# EAGLE design usbtinyisp_v2.0 (EAGLE 4.13)
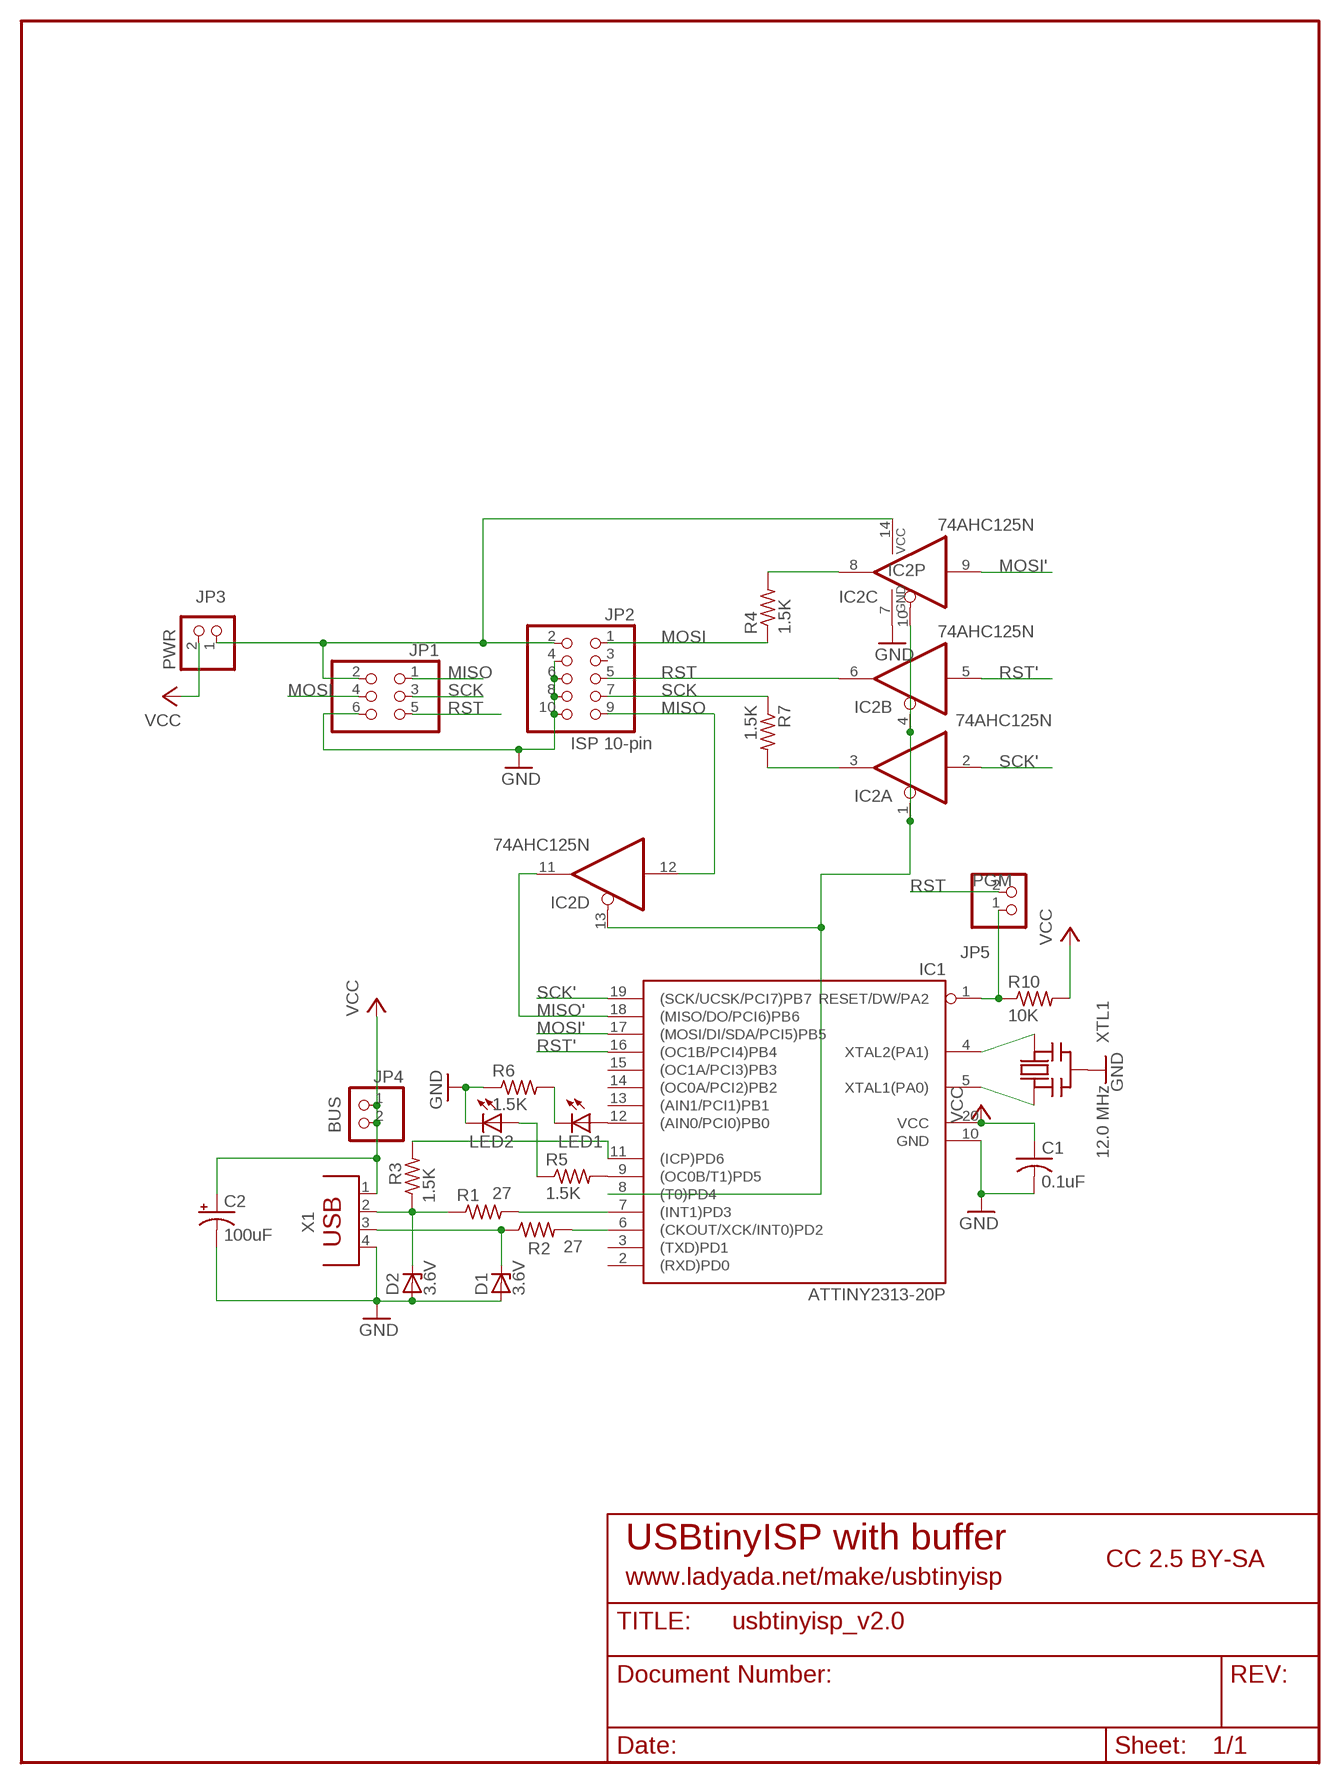
[diagram p0: schematic, sheet 1]

## Parts
C1  0.1uF  C-US025-025X050  [C025-025X050]
C2  100uF  CPOL-USE2.5-5  [E2,5-5]
D1  3.6V  ZENER-DIODEDO35Z10  [DO35Z10]
D2  3.6V  ZENER-DIODEDO35Z10  [DO35Z10]
IC1  ATTINY2313-20P  [DIL20]
IC2  74AHC125N  74HC125N  [DIL14]
JP1  PINHD-2X3  [2X03]
JP2  ISP 10-pin  PINHD-2X5  [2X05]
JP3  PWR  PINHD-1X2  [1X02]
JP4  BUS  PINHD-1X2  [1X02]
JP5  PGM  PINHD-1X2  [1X02]
LED1  LED3MM  [LED3MM]
LED2  LED3MM  [LED3MM]
R1  27  R-US_0207/10  [0207/10]
R2  27  R-US_0207/5V  [0207/5V]
R3  1.5K  R-US_0207/5V  [0207/5V]
R4  1.5K  R-US_0207/10  [0207/10]
R5  1.5K  R-US_0207/5V  [0207/5V]
R6  1.5K  R-US_0207/5V  [0207/5V]
R7  1.5K  R-US_0207/10  [0207/10]
R10  10K  R-US_0207/10  [0207/10]
X1  PN61729  [PN61729]
XTL1  12.0 MHz  CERMOSCILL  [CERM_OSC]

## Nets
GND: C1.2 C2.- D1.A D2.A IC1.10(GND) IC2.7(P:GND) JP1.6 JP2.4 JP2.6 JP2.8 JP2.10 LED2.K(C) R6.1 X1.4 XTL1.P$2(GND)
MISO: IC2.12(D:I) JP1.1 JP2.9
MISO': IC1.18((MISO/DO/PCI6)PB6) IC2.11(D:O)
MOSI: JP1.4 JP2.1 R4.1
MOSI': IC1.17((MOSI/DI/SDA/PCI5)PB5) IC2.9(C:I)
N$1: D2.C R1.1 R3.1 X1.2
N$2: D1.C R2.1 X1.3
N$3: IC1.7((INT1)PD3) R1.2
N$4: IC1.5(XTAL1(PA0)) XTL1.P$3(OUT)
N$5: IC1.4(XTAL2(PA1)) XTL1.P$1(IN)
N$6: IC1.6((CKOUT/XCK/INT0)PD2) R2.2
N$7: IC1.12((AIN0/PCI0)PB0) LED1.A
N$8: LED1.K(C) R6.2
N$9: IC1.1(RESET/DW/PA2) JP5.1 R10.1
N$10: IC1.9((OC0B/T1)PD5) R5.2
N$11: LED2.A R5.1
N$12: IC2.3(A:O) R7.2
N$13: IC2.8(C:O) R4.2
N$14: IC2.14(P:VCC) JP1.2 JP2.2 JP3.1
N$15: IC1.8((T0)PD4) IC2.1(A:OE) IC2.4(B:OE) IC2.10(C:OE) IC2.13(D:OE)
N$16: IC1.11((ICP)PD6) R3.2
RST: IC2.6(B:O) JP1.5 JP2.5 JP5.2
RST': IC1.16((OC1B/PCI4)PB4) IC2.5(B:I)
SCK: JP1.3 JP2.7 R7.1
SCK': IC1.19((SCK/UCSK/PCI7)PB7) IC2.2(A:I)
VCC: C1.1 C2.+ IC1.20(VCC) JP3.2 JP4.1 JP4.2 R10.2 X1.1
Unconnected: IC1.2((RXD)PD0) IC1.3((TXD)PD1) IC1.13((AIN1/PCI1)PB1) IC1.14((OC0A/PCI2)PB2) IC1.15((OC1A/PCI3)PB3) JP2.3

## Notes on the sheet
- USBtinyISP with buffer
- CC 2.5 BY-SA
- www.ladyada.net/make/usbtinyisp

## Library data of the parts
C1 = rcl-ez:C-US: CAPACITOR, American symbol
C2 = rcl-ez:CPOL-US: POLARIZED CAPACITOR, American symbol
D1 D2 = diode:ZENER-DIODE: Z-Diode
IC1 = avr:ATTINY2313: MICROCONTROLLER 2 Kbytes FLASH 128 bytes SRAM 128 bytes EEPROM USART USI
IC2 = 74xx-eu:74*125: Quad bus BUFFER, 3-state
JP1 = pinhead-ez:PINHD-2X3: PIN HEADER
JP2 = sonar:PINHD-2X5: PIN HEADER
JP3-JP5 = pinhead:PINHD-1X2: PIN HEADER
LED1 LED2 = minimidi:LED: LED OSRAM: - CHIPLED LG R971, LG N971, LY N971, LG Q971, LY Q971, LO R971, LY R971 LH N974, LH R974 LS Q976, LO Q976, LY Q976 LO Q996 - Hyper CHIPLED LW Q18S LB Q993, LB Q99A, LB R99A - SideLED LS A670, LO A670, LY A670, LG A670, LP A670 LB A673, LV A673, LT A673, LW A673 LH A674 LY A675 LS A676, LA A676, LO A676, LY A676, LW A676 LS A679, LY A679, LG A679 - Hyper Micro SIDELED® LS Y876, LA Y876, LO Y876, LY Y876 LT Y87S - SmartLED LW L88C, LW L88S LB L89C, LB L89S, LG L890 LS L89K, LO L89K, LY L89K LS L896, LA L896, LO L896, LY L896 - TOPLED LS T670, LO T670, LY T670, LG T670, LP T670 LSG T670, LSP T670, LSY T670, LOP T670, LYG T670 LG T671, LOG T671, LSG T671 LB T673, LV T673, LT T673, LW T673 LH T674 LS T676, LA T676, LO T676, LY T676, LB T676, LH T676, LSB T676, LW T676 LB T67C, LV T67C, LT T67C, LS T67K, LO T67K, LY T67K, LW E67C LS E67B, LA E67B, LO E67B, LY E67B, LB E67C, LV E67C, LT E67C LW T67C LS T679, LY T679, LG T679 LS T770, LO T770, LY T770, LG T770, LP T770 LB T773, LV T773, LT T773, LW T773 LH T774 LS E675, LA E675, LY E675, LS T675 LS T776, LA T776, LO T776, LY T776, LB T776 LHGB T686 LT T68C, LB T68C - Hyper Mini TOPLED® LB M676 - Mini TOPLED Santana® LG M470 LS M47K, LO M47K, LY M47K Source: http://www.osram.convergy.de/
R1-R7 R10 = rcl-ez:R-US_: RESISTOR, American symbol
X1 = con-berg-ez:PN61729: BERG USB connector
XTL1 = minimidi:CERMOSCILL

## Board
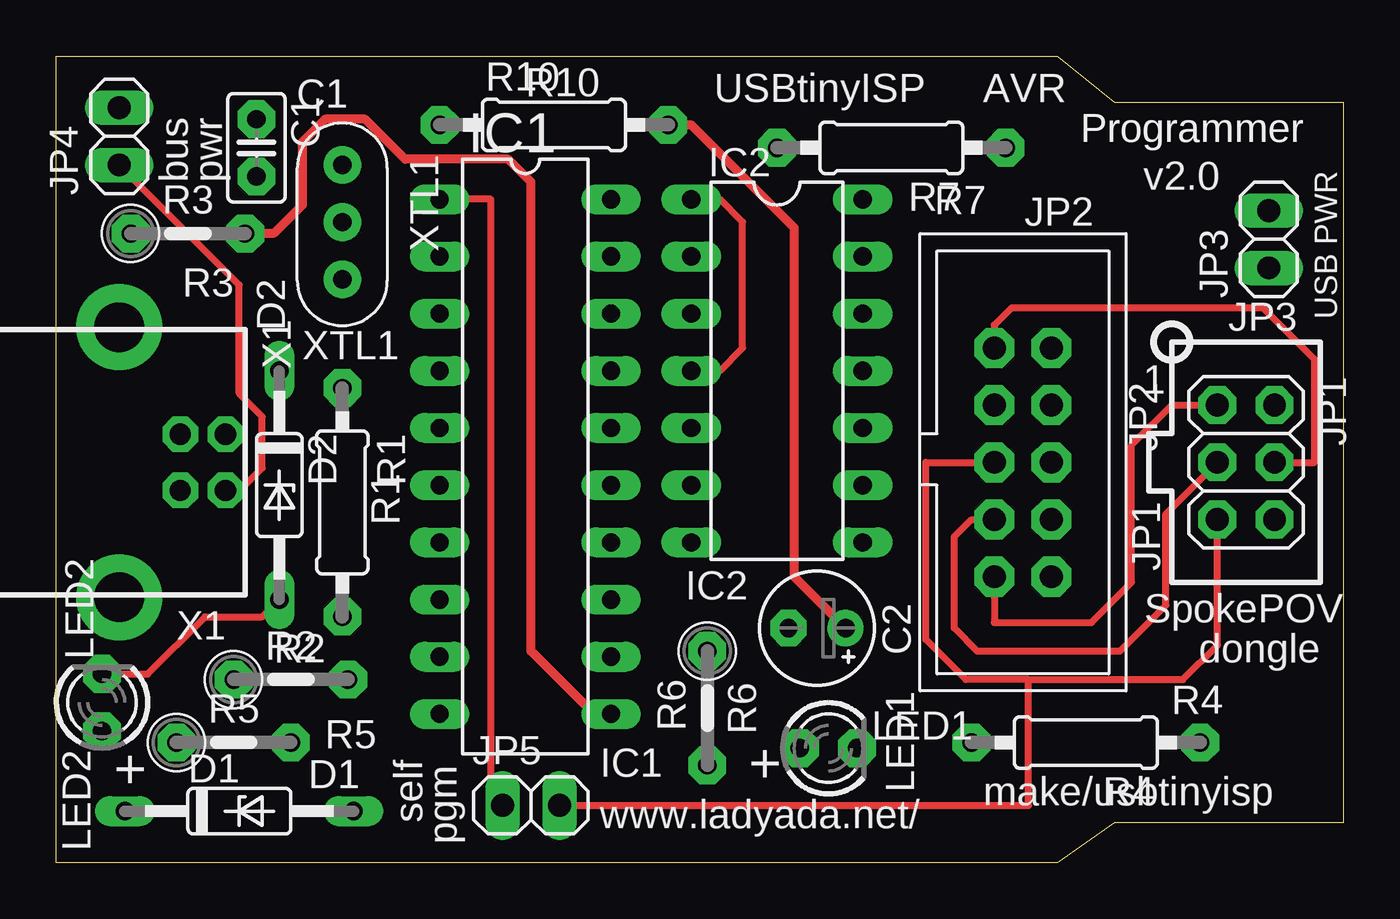
[diagram p1: board, top side]
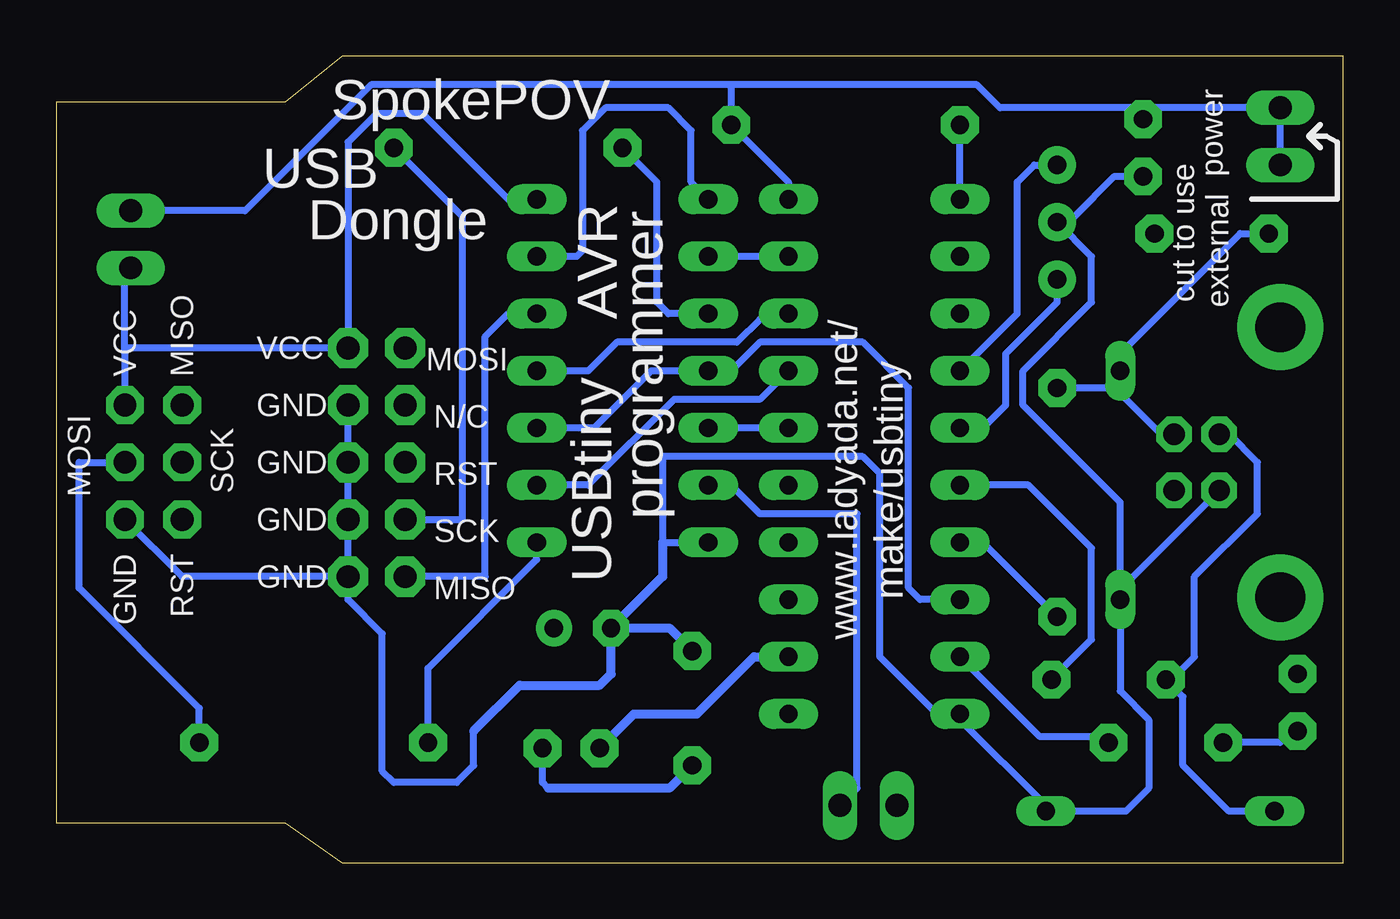
[diagram p2: board, bottom side, seen from below]

Size 57.15 x 35.81 mm. Coordinates in mm from the lower left corner, seen from the top.
Outline: 0,35.81 44.45,35.81 46.99,33.78 57.15,33.78 57.15,1.78 46.99,1.78 44.45,0 0,0 0,35.81
Copper layers (1*16): Top 0.035mm / dielectric 1.5mm / Bottom 0.035mm
Design rules "default": minimum track width 12mil, minimum drill 24mil, track to track 12mil, track to pad 12mil, pad to pad 12mil, via to via 12mil, smd to smd 0mil, copper to edge 20mil, drill to drill 8mil, minimum pad ring 10mil, minimum via ring 8mil, stop-mask expansion 4mil, vias tented up to drill 0mil, thermal gap 10mil

### Footprints (pad centres in the part's own frame; a part is rotated, then mirrored left to right if it is on the bottom)
C025-025X050 = drill 0.813 pad 1.676 octagon: 1 -1.27,0; 2 1.27,0
E2,5-5 = drill 0.813 pad 1.6 round: + -1.27,0 | drill 0.813 pad 1.6 octagon: - 1.27,0
DO35Z10 = drill 0.813 long: A 5.08,0; C -5.08,0
DIL20 = drill 0.813 long: 1 -11.43,-3.81; 2 -8.89,-3.81; 3 -6.35,-3.81; 4 -3.81,-3.81; 5 -1.27,-3.81; 6 1.27,-3.81; 7 3.81,-3.81; 8 6.35,-3.81; 9 8.89,-3.81; 10 11.43,-3.81; 11 11.43,3.81; 12 8.89,3.81; 13 6.35,3.81; 14 3.81,3.81; 15 1.27,3.81; 16 -1.27,3.81; 17 -3.81,3.81; 18 -6.35,3.81; 19 -8.89,3.81; 20 -11.43,3.81
DIL14 = drill 0.813 long: 1 -7.62,-3.81; 2 -5.08,-3.81; 3 -2.54,-3.81; 4 0,-3.81; 5 2.54,-3.81; 6 5.08,-3.81; 7 7.62,-3.81; 8 7.62,3.81; 9 5.08,3.81; 10 2.54,3.81; 11 0,3.81; 12 -2.54,3.81; 13 -5.08,3.81; 14 -7.62,3.81
2X03 = drill 1.016 pad 1.676 octagon: 1 -2.54,-1.27; 2 -2.54,1.27; 3 0,-1.27; 4 0,1.27; 5 2.54,-1.27; 6 2.54,1.27
2X05 = drill 1.016 pad 1.778 octagon: 1 -5.08,-1.27; 2 -5.08,1.27; 3 -2.54,-1.27; 4 -2.54,1.27; 5 0,-1.27; 6 0,1.27; 7 2.54,-1.27; 8 2.54,1.27; 9 5.08,-1.27; 10 5.08,1.27
1X02 = drill 1.016 long: 1 -1.27,0; 2 1.27,0
LED3MM = drill 0.813 pad 1.676 octagon: A -1.27,0; K 1.27,0
0207/10 = drill 0.813 pad 1.676 octagon: 1 -5.08,0; 2 5.08,0
0207/5V = drill 0.813 pad 1.676 octagon: 1 -2.54,0; 2 2.54,0
PN61729 = drill 0.95 pad 1.575 octagon: 1 1.25,4.71; 2 -1.25,4.71; 3 -1.25,2.71; 4 1.25,2.71 | drill 2.2 pad 3.81 round: P$1 -6,0; P$2 6,0
CERM_OSC = drill 0.813 pad 1.676 round: P$1 -2.54,0; P$2 0,0; P$3 2.54,0

### Placement (x,y rotation side)
C1  8.89,31.75 270 top
C2  33.78,10.41 180 top
D1  8.13,2.29 0 top
D2  9.91,16.76 270 top
IC1  20.83,18.03 270 top
IC2  32,21.84 270 top
JP1  52.83,17.78 270 top
JP2  42.93,17.78 270 top
JP3  53.85,27.69 90 top
JP4  2.79,32.26 90 top
JP5  21.08,2.54 0 top
LED1  34.29,5.08 0 top
LED2  2.03,7.11 90 top
R1  12.7,16 270 top
R2  10.41,8.13 0 top
R3  5.84,27.94 0 top
R4  45.72,5.33 180 top
R5  7.87,5.33 0 top
R6  28.91,6.86 270 top
R7  37.08,31.75 180 top
R10  22.1,32.77 0 top
X1  2.79,17.78 270 top
XTL1  12.7,28.45 270 top

### Tracks (layer width: path | path; a pad name or v marks a point on that pad's centre or on a via)
GND
  Top 0.305: LED2.K 4.06,8.38 6.6,10.92 9.14,10.92 D2.A
  Bottom 0.305: C1.2 10.16,30.48 11.94,28.7 12.7,28.7 XTL1.P$2 11.18,26.92 11.18,24.89 14.22,21.84 14.22,20.32 9.91,16 D2.A | D2.A 9.65,11.68 9.65,12.38 X1.4 | JP2.10 JP2.8 JP2.6 JP2.4 | JP1.6 51.56,12.7 JP2.10 | JP2.10 44.2,11.68 42.67,10.16 42.67,4.06 42.16,3.56 39.37,3.56 38.61,4.32 38.61,5.84 | 12.45,2.29 9.65,2.29 8.64,3.3 8.64,6.35 9.91,7.62 D2.A | 12.45,2.29 12.7,2.29 | 12.45,2.29 D1.A 13.21,2.54 17.02,6.35 IC1.10 18.03,6.6 20.57,9.14 20.57,17.27 21.34,18.03 30.23,18.03 30.23,14.22 IC2.7
  Bottom 0.406: R6.1 29.93,10.41 C2.- | C2.- 30.23,12.7 30.23,14.22 | 38.61,5.84 36.58,7.87 33.02,7.87 32.51,8.38 C2.-
MISO
  Top 0.305: JP2.9 41.66,10.67 45.97,10.67 47.75,12.45 47.75,18.54 49.53,20.32 JP1.1
  Bottom 0.305: 41.91,12.7 JP2.9 38.1,12.7 38.1,23.37 37.08,24.38 IC2.12
MISO'
  Bottom 0.305: IC2.11 33.53,21.84 32.26,23.11 26.92,23.11 25.91,24.13 25.15,24.13 24.89,24.38 IC1.18
MOSI
  Top 0.305: JP2.1 41.66,23.88 42.42,24.64 53.59,24.64 55.88,22.35 55.88,17.78 JP1.4
  Bottom 0.305: R4.1 50.8,6.86 56.13,12.19 56.13,17.78 JP1.4
MOSI'
  Bottom 0.305: IC1.17 25.91,20.57 29.72,20.57 33.53,16.76 IC2.9 36.07,16.76
N$1
  Bottom 0.305: 9.91,21.08 R1.1 | R3.1 4.57,27.94 9.91,22.61 D2.C 9.91,21.08 | X1.2 8.11,19.03 9.91,20.83 9.91,21.08
N$2
  Bottom 0.305: X1.3 5.06,19.03 3.81,17.78 3.81,15.49 6.6,12.7 6.6,9.14 7.62,8.13 R2.1 7.11,7.37 7.11,4.32 5.08,2.29 D1.C
N$3
  Bottom 0.305: R1.2 16,14.22 IC1.7
N$4
  Bottom 0.305: XTL1.P$3 12.7,24.89 14.99,22.61 14.99,20.32 16,19.3 IC1.5
N$5
  Bottom 0.305: XTL1.P$1 13.72,30.99 14.48,30.23 14.48,24.38 IC1.4
N$6
  Bottom 0.305: R2.2 11.18,9.91 11.18,13.97 13.97,16.76 IC1.6
N$7
  Bottom 0.305: IC1.12 25.65,9.14
  Bottom 0.406: LED1.A 31.5,6.6 28.7,6.6 26.16,9.14 25.65,9.14
N$8
  Bottom 0.305: 35.31,3.3 35.56,3.56 LED1.K
  Bottom 0.406: R6.2 29.93,3.3 35.31,3.3
N$9
  Top 0.305: JP5.1 19.3,3.05 19.3,29.46 IC1.1
  Bottom 0.305: IC1.1 R10.1
N$10
  Bottom 0.305: IC1.9 13.46,5.59 10.67,5.59 R5.2
N$11
  Bottom 0.305: LED2.A 2.29,5.84 2.79,5.33 R5.1
N$12
  Bottom 0.305: IC2.3 29.97,24.38 30.48,24.89 30.48,30.23 R7.2
N$13
  Bottom 0.305: R4.2 40.64,8.64 35.81,13.46 IC2.8
N$14
  Bottom 0.305: JP2.2 43.94,22.61 | 54.1,20.07 JP1.2 54.1,22.61 | JP3.1 54.1,26.42 54.1,22.61 | JP2.2 54.1,22.86 54.1,22.61 | JP2.2 44.2,32 42.93,33.27 40.89,33.27 37.08,29.46 IC2.14
N$15
  Top 0.305: IC2.1 29.46,29.46 30.48,28.45 30.48,22.86 29.46,21.84 IC2.4 27.69,21.84
  Bottom 0.305: IC2.10 33.27,19.3 30.73,21.84 IC2.4 27.18,21.84 25.91,23.11 21.34,23.11 19.3,21.08 19.3,12.19 18.8,11.68 IC1.8 | IC2.13 34.04,26.92 33.78,27.18 33.78,32.51 32.77,33.53 29.97,33.53 28.96,32.51 28.96,30.23 IC2.1
N$16
  Top 0.406: R3.2 9.65,27.94 10.92,29.21 10.92,32 11.94,33.02 13.72,33.02 15.49,31.24 20.07,31.24 21.08,30.23 21.08,9.4 23.88,6.6 IC1.11 24.89,6.6
RST
  Top 0.305: JP1.5 51.56,9.65 50.04,8.13 43.18,8.13 | 43.18,8.13 40.39,8.13 38.61,9.91 38.61,17.78 JP2.5 | JP5.2 43.18,2.54 43.18,8.13
  Bottom 0.305: JP5.2 21.59,3.3 21.59,15.49 25.91,15.49 27.18,16.76 IC2.6
RST'
  Bottom 0.305: IC1.16 IC2.5
SCK
  Top 0.305: JP1.3 49.28,15.49 49.28,11.43 47.24,9.4 40.89,9.4 39.88,10.41 39.88,14.48 40.64,15.24 JP2.7
  Bottom 0.305: JP2.7 39.12,15.24 39.12,28.7 R7.1
SCK'
  Bottom 0.305: IC1.19 IC2.2
VCC
  Top 0.305: X1.1 8.15,16.53 9.14,17.53 9.14,19.81 8.13,20.83 8.13,25.65 JP4.1
  Top 0.406: C2.+ 32.77,12.7 32.77,28.19 28.19,32.77 R10.2
  Bottom 0.305: 8.89,33.53 JP4.2 JP4.1 | 8.89,33.53 C1.1 | 8.89,33.53 15.24,33.53 16.26,34.54 27.18,34.54 | JP3.2 48.77,28.96 43.18,34.54 27.18,34.54 | IC1.20 24.64,30.23 R10.2 27.18,34.54

### Text on the board
tPlace: C1 | R10 | USBtinyISP | AVR | Programmer | v2.0 | USB PWR | bus | pwr | JP2 | R7 | R3 | JP3 | D2 | XTL1 | 1 | R1 | JP1 | IC2 | SpokePOV | X1 | dongle | R2 | LED1 | R4 | R5 | R6 | self | IC1 | pgm | + | + | D1 | make/usbtinyisp | www.ladyada.net/ | LED2
bPlace: SpokePOV | power | external | USB | programmer | Dongle | cut to use | AVR | MOSI | VCC | MISO | VCC | GND | N/C | SCK | RST | GND | MOSI | GND | SCK | RST | GND | make/usbtiny | USBtiny | MISO | GND | www.ladyada.net/